# Altium schematic sheet MCU_STM32H743BI_POWER.SchDoc: MCU_STM32H743BI_POWER
size A3; Author: A.Horvath; Organization: Reichle & De-Massari; Address1: Binzstrasse 32; Address2: 8620 Wetzikon; Address3: Switzerland; DocumentNumber: 7; Revision: V0.1; SheetNumber: 7; SheetTotal: 11
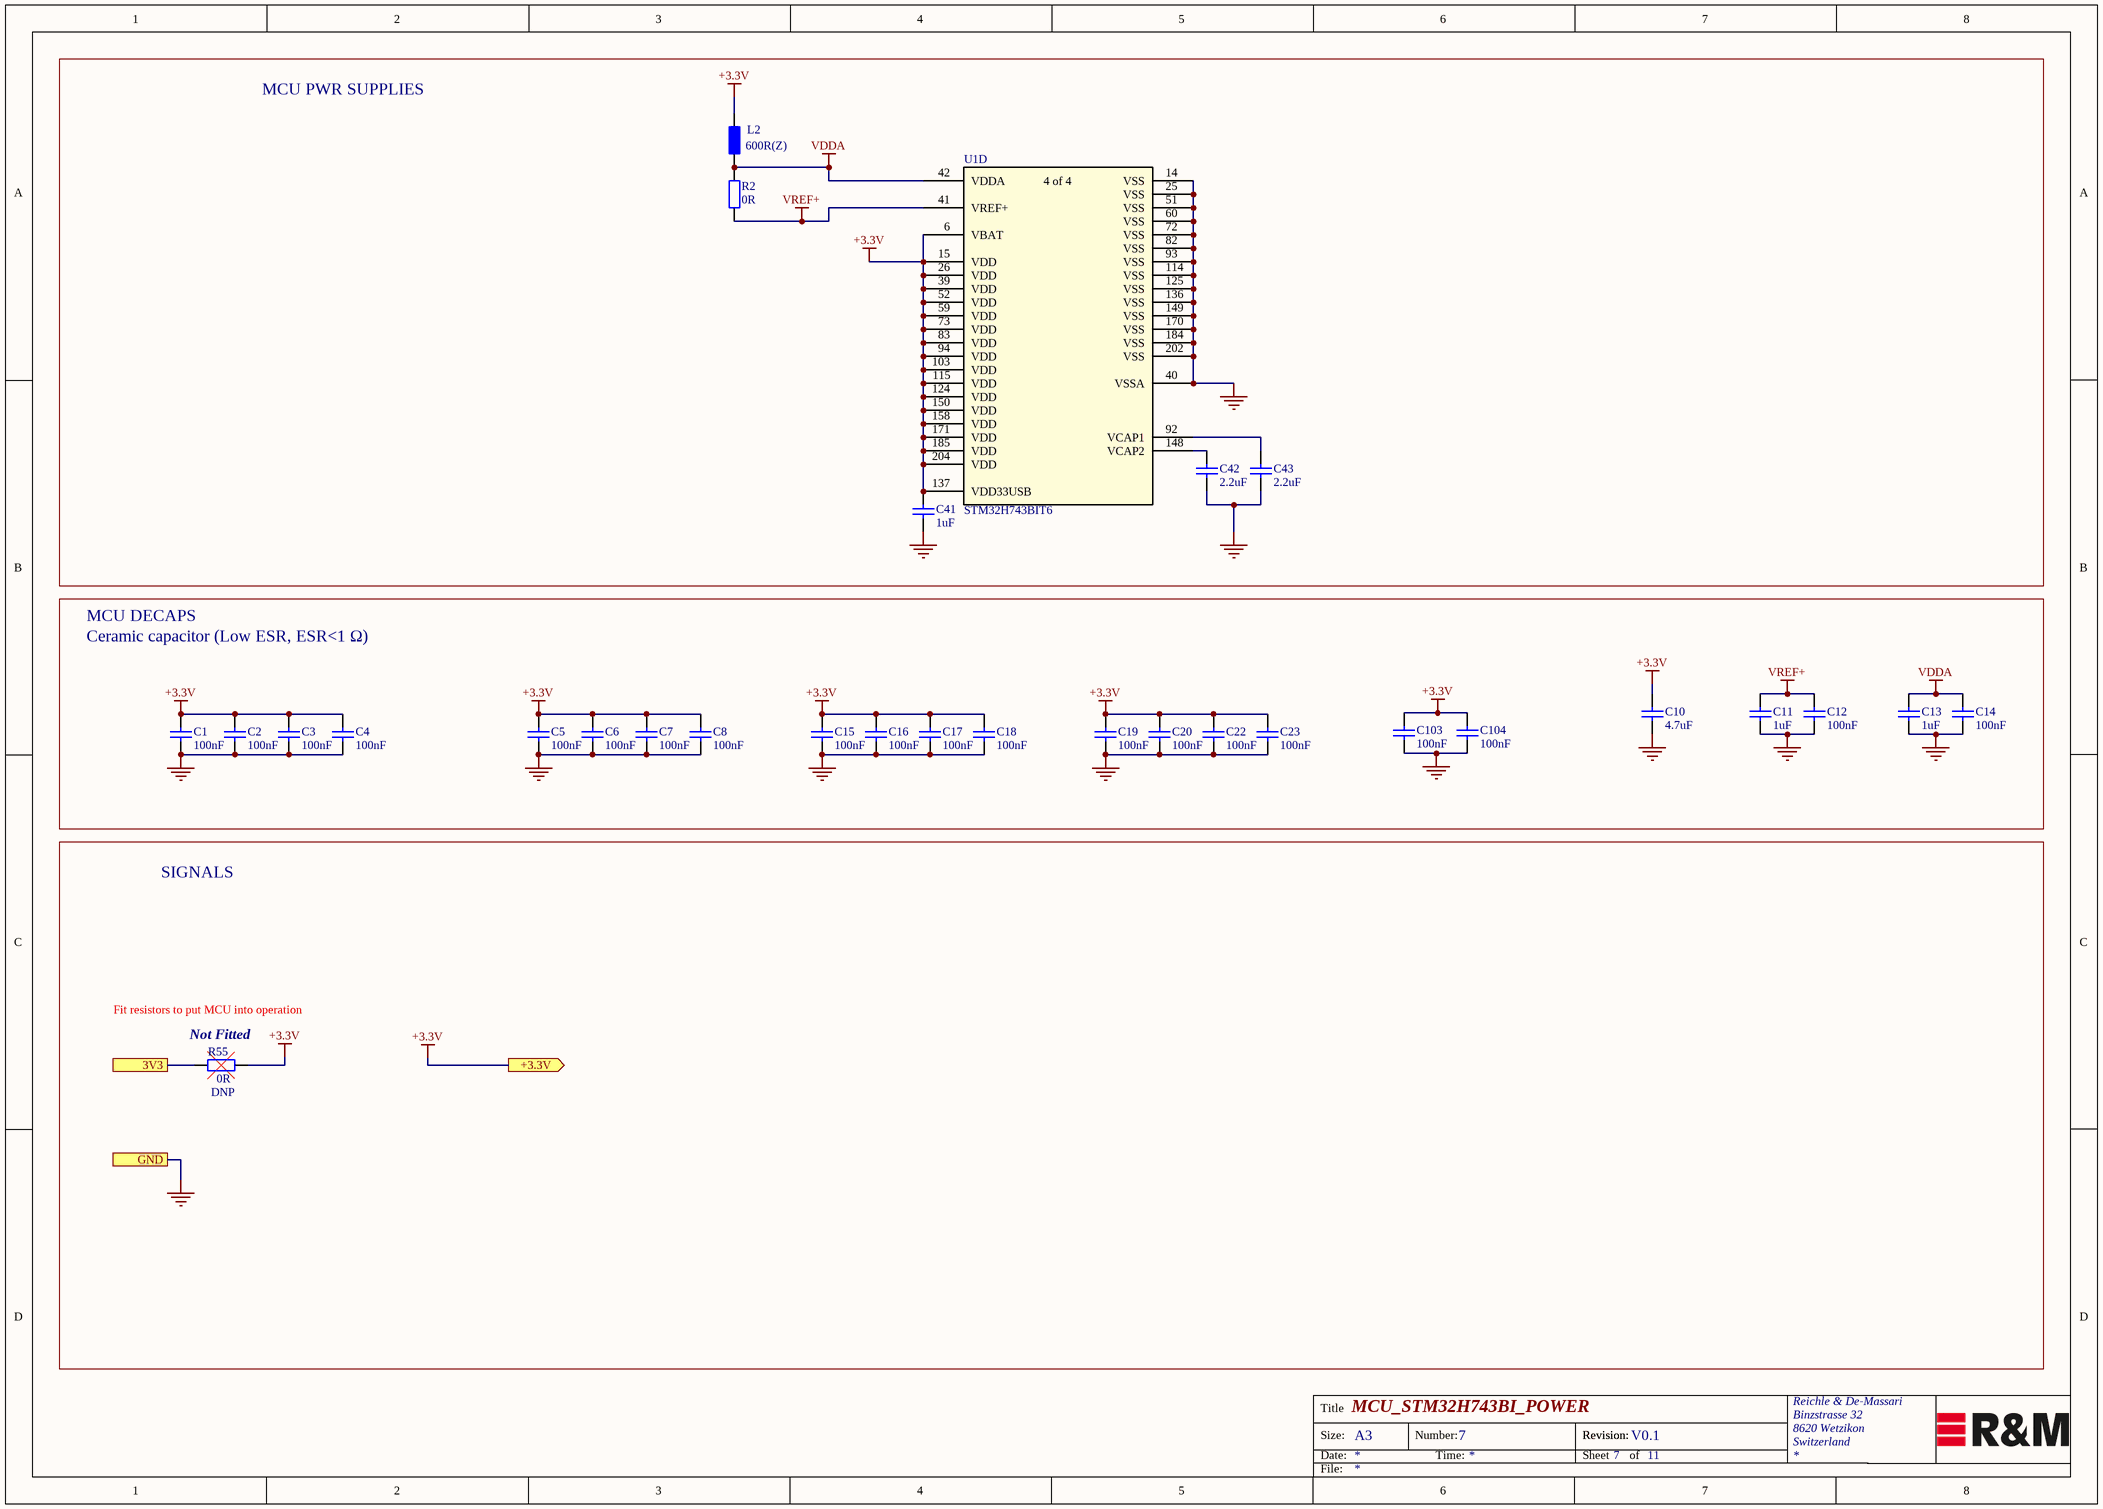
[diagram p0: MCU_STM32H743BI_POWER.SchDoc]

## Parts
C1  100nF  [Ceramic Capacitor 0402 EIA]
C2  100nF  [Ceramic Capacitor 0402 EIA]
C3  100nF  [Ceramic Capacitor 0402 EIA]
C4  100nF  [Ceramic Capacitor 0402 EIA]
C5  100nF  [Ceramic Capacitor 0402 EIA]
C6  100nF  [Ceramic Capacitor 0402 EIA]
C7  100nF  [Ceramic Capacitor 0402 EIA]
C8  100nF  [Ceramic Capacitor 0402 EIA]
C10  4.7uF  [Ceramic Capacitor 0603 EIA]
C11  1uF  [Ceramic Capacitor 0603 EIA]
C12  100nF  [Ceramic Capacitor 0402 EIA]
C13  1uF  [Ceramic Capacitor 0603 EIA]
C14  100nF  [Ceramic Capacitor 0402 EIA]
C15  100nF  [Ceramic Capacitor 0402 EIA]
C16  100nF  [Ceramic Capacitor 0402 EIA]
C17  100nF  [Ceramic Capacitor 0402 EIA]
C18  100nF  [Ceramic Capacitor 0402 EIA]
C19  100nF  [Ceramic Capacitor 0402 EIA]
C20  100nF  [Ceramic Capacitor 0402 EIA]
C22  100nF  [Ceramic Capacitor 0402 EIA]
C23  100nF  [Ceramic Capacitor 0402 EIA]
C41  1uF  [Ceramic Capacitor 0603 EIA]
C42  2.2uF  [Ceramic Capacitor 0402 EIA]
C43  2.2uF  [Ceramic Capacitor 0402 EIA]
C103  100nF  [Ceramic Capacitor 0402 EIA]
C104  100nF  [Ceramic Capacitor 0402 EIA]
L2  600R(Z)  [Inductor 0603 EIA]
R2  0R  [Resistor 0603 EIA]
R55  DNP  [Resistor 0805 EIA]
U1  STM32H743BIT6  [LQFP208_STM32H743BITx]  (part D of 4)

## Blocks framed on the sheet
MCU PWR SUPPLIES: C41-C43 L2 R2 U1
SIGNALS: R55

## Ports
3V3, +3.3V (out), GND

## Nets
+3.3V: C1.2 C2.2 C3.2 C4.2 C5.2 C6.2 C7.2 C8.2 C10.2 C15.2 C16.2 C17.2 C18.2 C19.2 C20.2 C22.2 C23.2 C41.2 C103.2 C104.2 L2.1 R55.2 U1.6(VBAT) U1.15(VDD) U1.26(VDD) U1.39(VDD) U1.52(VDD) U1.59(VDD) U1.73(VDD) U1.83(VDD) U1.94(VDD) U1.103(VDD) U1.115(VDD) U1.124(VDD) U1.137(VDD33USB) U1.150(VDD) U1.158(VDD) U1.171(VDD) U1.185(VDD) U1.204(VDD) ; port +3.3V
GND: C1.1 C2.1 C3.1 C4.1 C5.1 C6.1 C7.1 C8.1 C10.1 C11.1 C12.1 C13.1 C14.1 C15.1 C16.1 C17.1 C18.1 C19.1 C20.1 C22.1 C23.1 C41.1 C42.1 C43.1 C103.1 C104.1 U1.14(VSS) U1.25(VSS) U1.40(VSSA) U1.51(VSS) U1.60(VSS) U1.72(VSS) U1.82(VSS) U1.93(VSS) U1.114(VSS) U1.125(VSS) U1.136(VSS) U1.149(VSS) U1.170(VSS) U1.184(VSS) U1.202(VSS) ; port GND
VDDA: C13.2 C14.2 L2.2 R2.1 U1.42(VDDA)
VREF+: C11.2 C12.2 R2.2 U1.41(VREF+)
3V3: R55.1 ; port 3V3
NetC42_2: C42.2 U1.148(VCAP2)
NetC43_2: C43.2 U1.92(VCAP1)

## Notes on the sheet
- MCU DECAPS
- Ceramic capacitor (Low ESR, ESR<1 Ω)
- (near R55) Fit resistors to put MCU into operation
- (near R55) Not Fitted
- (near R55) 0R
- Title
- Size:
- Date:
- A3
- Number:
- Time:
- Revision:
- Sheet
- of
- File:
- (in symbol STM32H7x3BIT, part D) 4 of 4

## Library data of the parts
C1-C8 C12 C14-C20 C22 C23 C103 C104 = Cap_100nF_0402_10V: 0,1µF ±10% 10V Keramikkondensatoren X7R 0402 (1005 metrisch); Manufacturer: Samsung; Manufacturer PartNr: CC0402KRX7R6BB104; Replaceable: yes; volatage: 10VDC; Dielectric Grade: X7R; Footprint/Package: 0402 (1005 metric); Supplier 1: Digi-Key; Supplier Part Number 1: 1276-1002-1-ND; value: 100nF
C10 = Cap_4.7uF_0603_10V: 4.7µF ±10% 10V Ceramic Capacitor X5R 0603 (1608 Metric); Manufracturer: KEMET; Manufacturer PartNr: C0603C475K8PACTU; voltage: 10VDC; Replaceable: yes; value: 4.7uF; tolerance: 10%; Dielectric Grade: X5R; Footprint/Package: 0603 (1608 metric); Supplier 1: Digi-Key; Supplier Part Number 1: 399-5503-1-ND
C11 C13 C41 = Cap_1uF_0603_25V: 1µF ±10% 25V Ceramic Capacitor X5R 0603 (1608 Metric); Manufacturer: Kemet; Manufacturer PartNr: C0603C105K3PACTU; voltage: 25VDC; Replaceable: yes; value: 1uF; tolerance: 10%; Footprint/Package: 0603 (1608 metrisch); Dielectric Grade: X5R; ComponentLink1Description: mouser; ComponentLink1URL: https://www.mouser.ch/ProductDetail/Murata-Electronics/GCM155C71A105KE38D?qs=sGAEpiMZZMsh%252b1woXyUXj0FEAttKcN54ouz5zO04smg%3d; Supplier Part Number 1: 399-7846-1-ND; Supplier 1: Digi-Key
C42 C43 = Cap_2.2uF_0402_25V: 2.2µF ±20% 25V Ceramic Capacitor X5R 0402 (1005 Metric); Manufacturer: Murata; Manufacturer PartNr: GRM155R61E225ME15D; voltage: 25VDC; Replaceable: yes; value: 2.2uF; tolerance: ±20%; Dielectric Grade: X5R; Footprint/Package: 0402; ComponentLink1Description: digikey; ComponentLink1URL: https://www.digikey.com/product-detail/en/murata-electronics-north-america/GRM155R61E225ME15D/490-10457-2-ND/5027542; Supplier 1: Digi-Key; Supplier Part Number 1: 490-10457-1-ND
L2 = Ind_600R_0603: Ferritperlen MULTILYR CHP BD 0603 600OHMS 25%; Manufacturer: Taiyo Yuden; Manufacturer PartNr: BK1608HS601-T; Replaceable: yes; current: 350mA; value: 600R(Z); tolerance: 25%; power: *; Footprint/Package: 0603; Supplier 1: Mouser; Supplier Part Number 1: 963-BK1608HS601-T
R2 = Res_0R_0603: 0 Ohms Jumper 0.1W, 1/10W Chip Resistor 0603 (1608 Metric) Moisture Resistant Thick Film; Manufacturer: Yageo; Manufacturer PartNr: RC0603JR-070RL; Replaceable: yes; value: 0R; tolerance: -; power: 0.1W, 1/10W; Footprint/Package: 0603 (1608 metric); Supplier 1: Digi-Key; Supplier Part Number 1: 311-0.0GRCT-ND; voltage: -; Dielectric Grade: -
R55 = Res_DNP_0805: Resistor: do not populate; Replaceable: no; value: DNP; tolerance: *; power: *; Manufacturer: do not populate; Footprint/Package: 0805; Manufacturer PartNr: do not populate
U1 = STM32H7x3BIT: ARM Cortex-M7 STM32H7 Mikrocontroller IC 32-Bit 480MHz 2MB (2M x 8) FLASH 208-LQFP (28x28); Manufacturer: STMicroelectronics; voltage: 1,62V-3.6V; Replaceable: no; value: STM32H743BIT6; Type: Type; DIelectric Grade: -; Manufacturer PartNr: STM32H743BIT6; power: -; Supplier 1: Digi-Key; Supplier Part Number 1: 497-18562-ND; Footprint/Package: 208-LQFP (28x28); tolerance: -